# Altium schematic sheet PSU.SchDoc: Wprowadź Tytuł
size A4; CheckedBy: Wprowadź sprawdzającego; DrawnBy: Wprowadź autora; Organization: Koło Naukowe Robotyków; Address1: Nowowiejska 24; Address2: 00-001; Address3: Wraszawa; Address4: Polska; Revision: Numer; Nazwa Arkusza: Wpisz nazwę arkusza; ProjectName: Nazwa Projektu
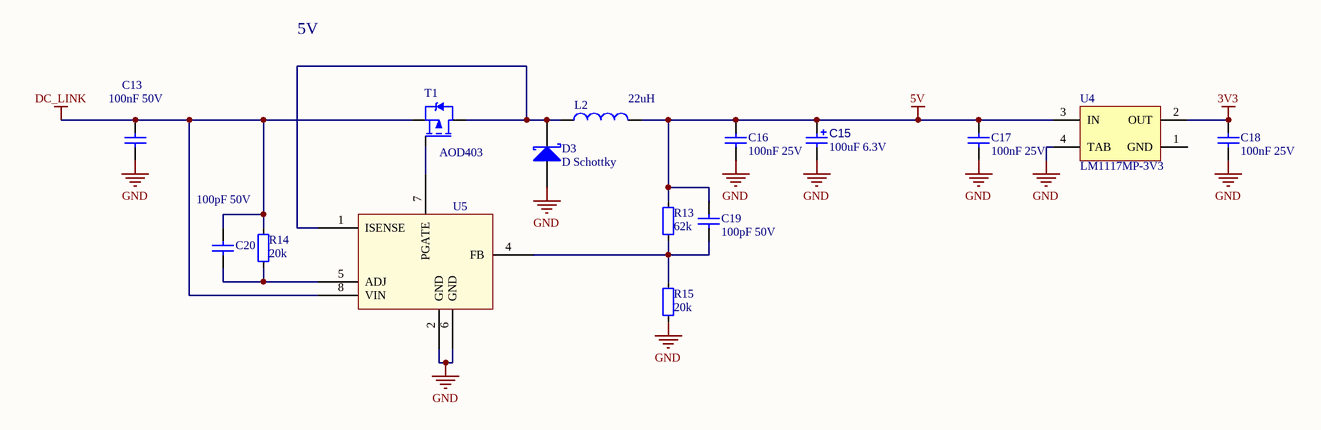
[diagram p0: PSU.SchDoc]

## Parts
C13  100nF 50V  [0603_CAP]
C15  100uF 6.3V  [Con_SMD_6.3x5.5]
C16  100nF 25V  [0603_CAP]
C17  100nF 25V  [0603_CAP]
C18  100nF 25V  [0603_CAP]
C19  100pF 50V  [0603_CAP]
C20  100pF 50V  [0603_CAP]
D3  D Schottky  [SMB]
L2  22uH  [PA4341.223ANLT]
R13  62k  [0603]
R14  20k  [0603]
R15  20k  [0603]
T1  AOD403  [DPAK TO-252]
U4  LM1117MP-3V3  [SOT223]
U5  LM3485  [VSSOP8]  (value not drawn)

## Nets
3V3: C18.2 U4.2(OUT)
5V: C15.1 C16.2 C17.2 C19.2 L2.2 R13.2 U4.3(IN)
DC_LINK: C13.2 C20.2 R14.2 T1.3(S) U5.8(VIN)
GND: C13.1 C15.2 C16.1 C17.1 C18.1 D3.1(A) R15.1 U4.4(TAB) U5.2(GND) U5.6(GND)
NetC19_1: C19.1 R13.1 R15.2 U5.4(FB)
NetC20_1: C20.1 R14.1 U5.5(ADJ)
NetD3_2: D3.2(K) L2.1 T1.2(D) U5.1(ISENSE)
NetT1_1: T1.1(G) U5.7(PGATE)

Not connected (* = marked no-connect by the designer): U4 1(GND)

## Notes on the sheet
- 5V
- Narysował
- Sprawdził
- Projekt
- Date:
- Wersja
- Plik

## Library data of the parts
C13 C16-C20 = Cap: Ceramic capacitor; Unit Price1: *; Unit Price2: *
  C13: Value: 100nF 50V
  C16-C18: Value: 100nF 25V
  C19 C20: Value: 100pF 50V
C15 = Cap_Pol: Polar capacitor; Value: 100uF 6.3V
D3 = D Schottky: Schottky Diode; Published: 8-Jun-2000; LatestRevisionDate: 17-Jul-2002; LatestRevisionNote: Re-released for DXP Platform.; PackageReference: SMB; Publisher: Altium Limited; PackageDescription: DO-214-AA/SMB; 2 C-Bend Leads; Body 5.3 x 3.6 mm, inc. leads (LxW); Code_JEDEC: DO-214-AA
L2 = Inductor
R13-R15 = RES: Resistior
  R13: Value: 62k
  R14 R15: Value: 20k
T1 = p-mosfet: AEC Generic p-mosfet; part_number: AOD403
U4 = LM1117MP-3V3: 800mA Low-Dropout Linear Regulator; PartNumber: LM1117MP-3.3; Manufacturer: National Semiconductor; CompType: LDO IC; PackageTopMarking: XYTT*N05A; PowerWise: N; Published: 4-Dec-2008; DatasheetVersion: Apr-2006; PackageVersion: revB, Apr-2003; PackageReference: MP04A; Publisher: Altium Limited; PackageDescription: Molded SOT-223, 6.50 x 3.56 x 1.6mm Body, 4 Lead, 2.3mm Pitch; RoHS: O; PinCount: 4; DigiKeyPartNumber: LM1117MP-3.3CT-ND; Code_JEDEC: TO-261-AA; Code_IPC: SOT223-4; ComponentLink1Description: LM1117 Datasheet; ComponentLink1URL: http://www.national.com/ds/LM/LM1117.pdf; ComponentLink2Description: LM1117 Web Page; ComponentLink2URL: http://www.national.com/pf/LM/LM1117.html; ComponentLink3Description: MP04A Package Page; ComponentLink3URL: http://www.national.com/packaging/folders/mp04a.html
U5 = LM3485: HelpURL: C:\Users\micha\Documents\Studia\Inżynierka\Elektronika\Datasheets\LM3485.pdf